# Altium project test.PrjPCB
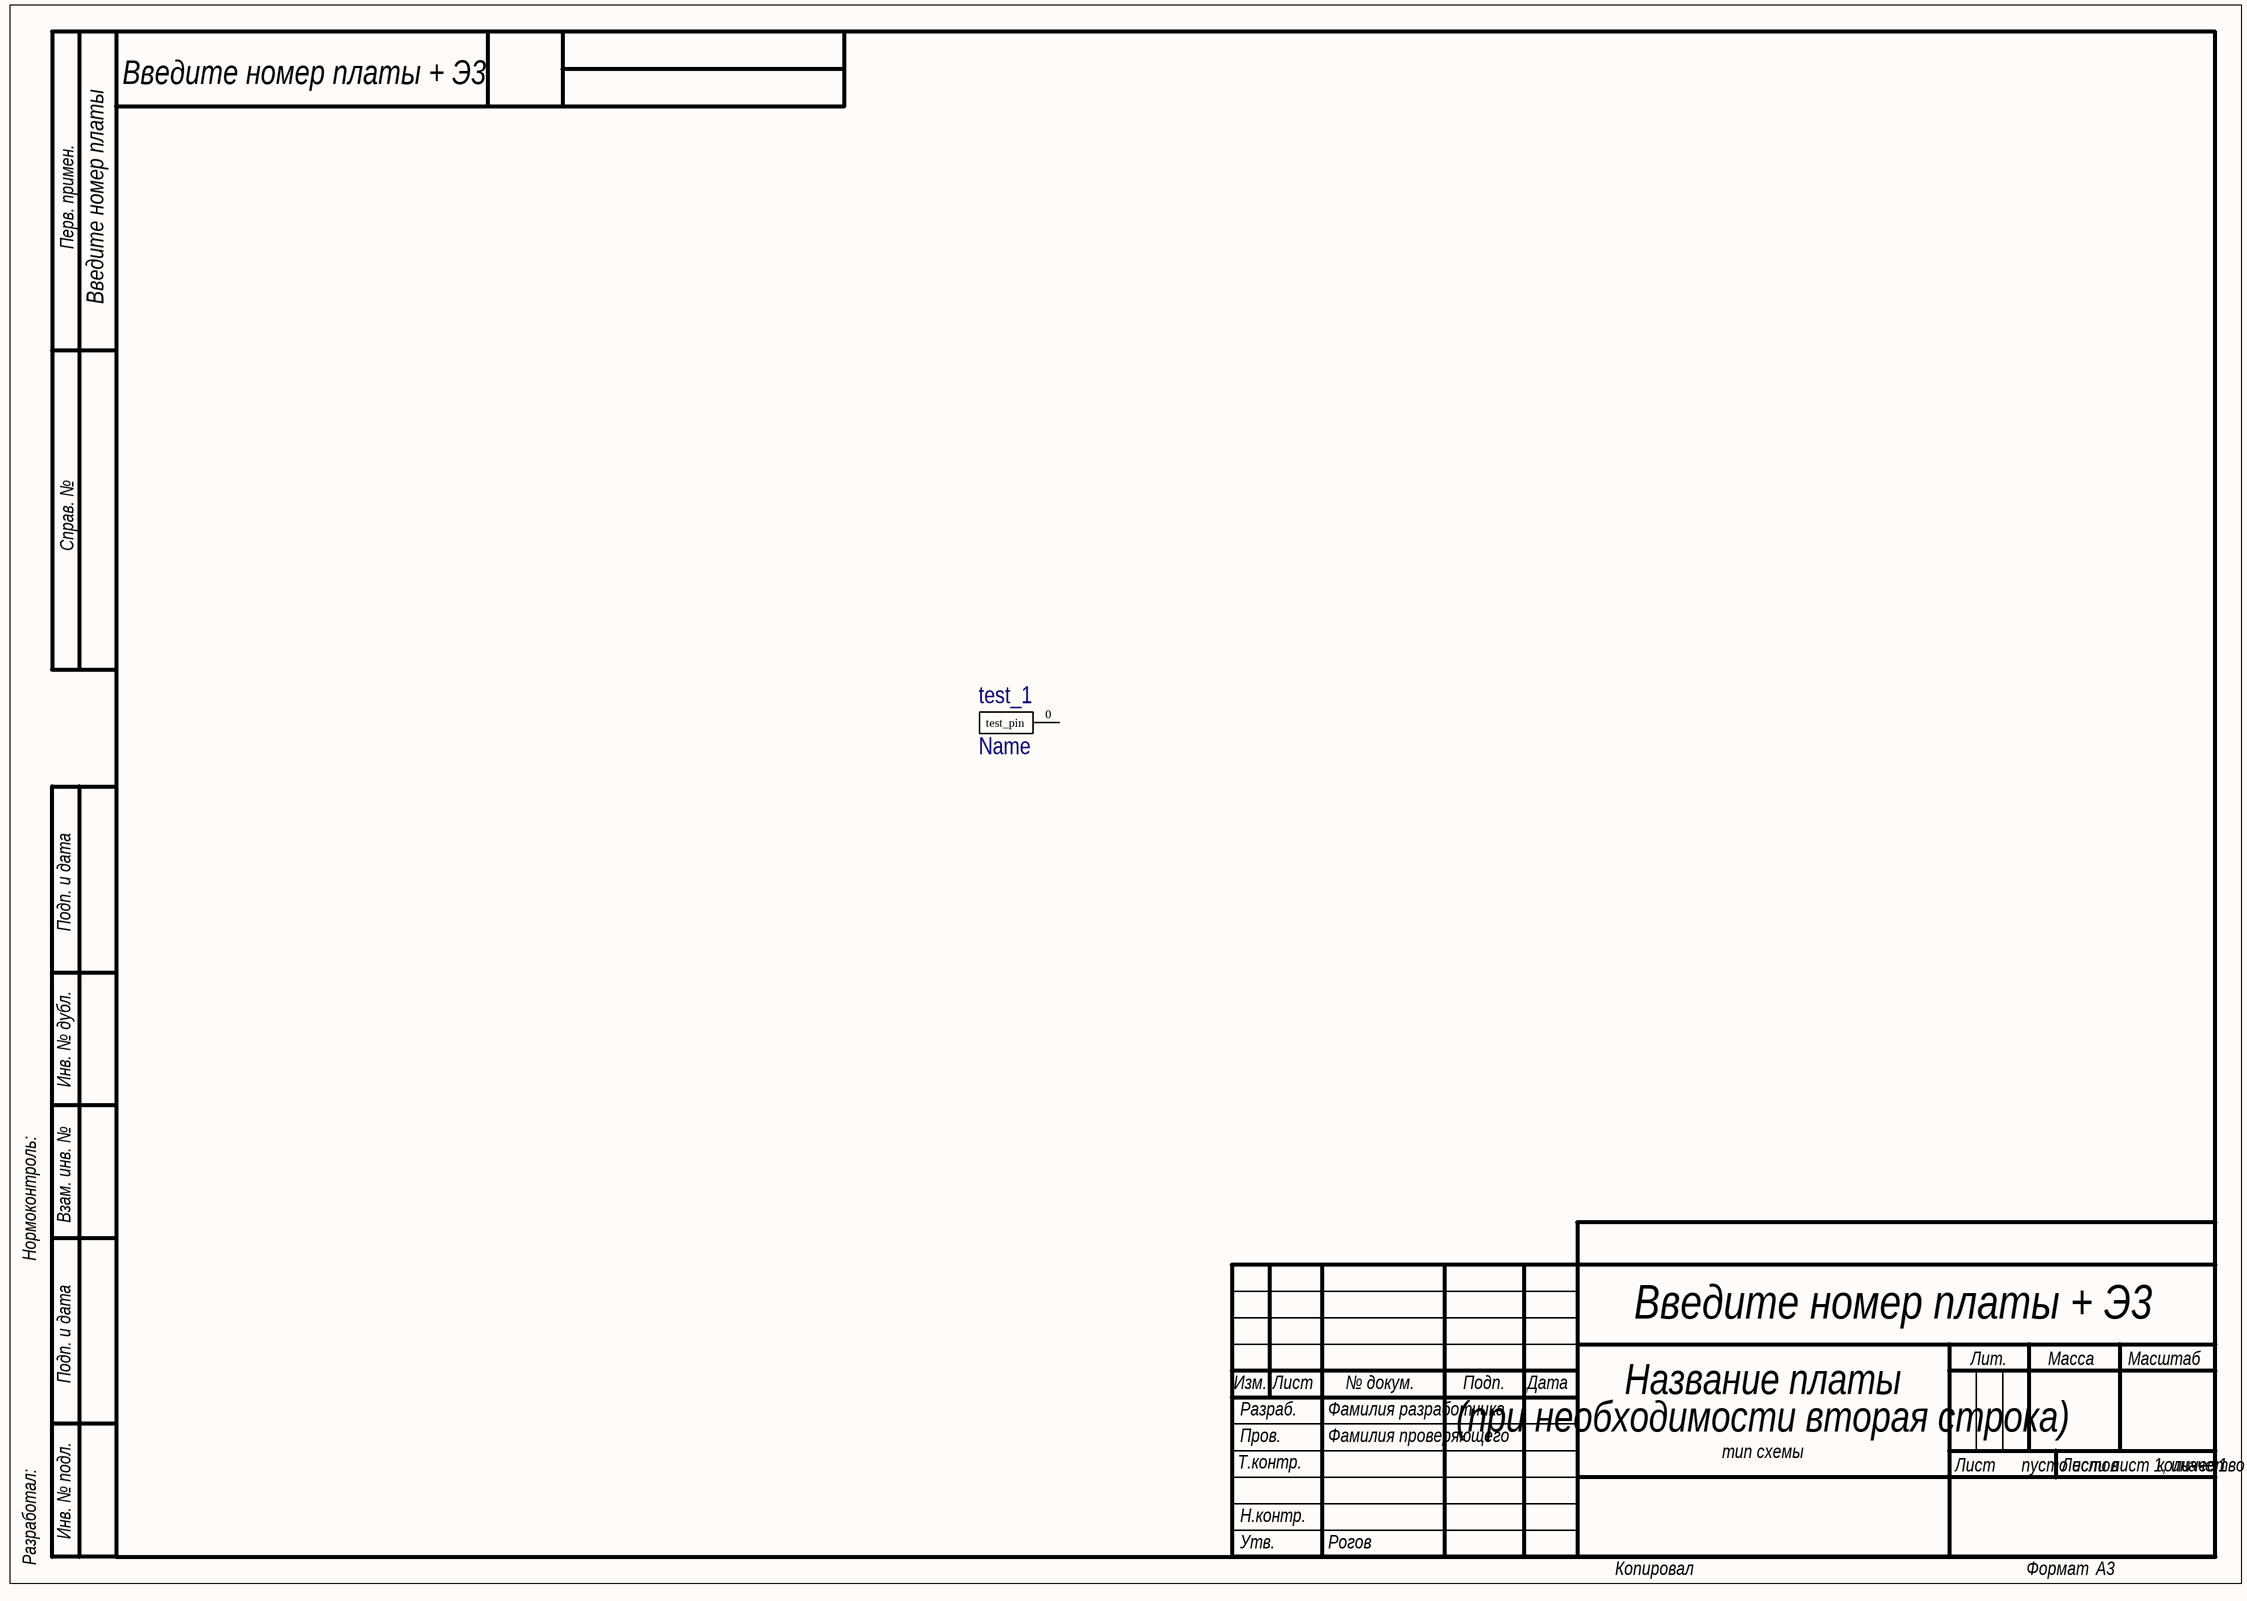
[diagram p0: test.SchDoc]
1 sheet, 1 parts. Net scope: global (net labels, ports and power ports of the same name join across sheets).

## Sheet test.SchDoc: Название платы
size 420 x 297 mm; ApprovedBy: Рогов; CheckedBy: Фамилия проверяющего; DrawnBy: Фамилия разработчика; DocumentNumber: Введите номер платы + Э3; SheetNumber: пусто если лист 1, иначе 1; SheetTotal: количество листов; Title1str: (при необходимости вторая строка); DocumentType: тип схемы; Format: A3; ImagePath: Введите номер платы

### Parts
test_1  Name

### Nets

Not connected (* = marked no-connect by the designer): test_1 0(test_pin)

### Notes on the sheet
- Перв. примен.
- Справ. №
- Подп. и дата
- Инв. № дубл.
- Нормоконтроль:
- Взам. инв. №
- Изм.
- Лист
- № докум.
- Подп.
- Дата
- Лит.
- Масса
- Масштаб
- Т.контр.
- Пров.
- Разраб.
- Листов
- Разработал:
- Инв. № подл.
- Н.контр.
- Утв.
- Копировал
- Формат

### Library data of the parts
test_1 = test_component: name: Test_name